# Altium schematic sheet SPDT_FET_SW_driver.SchDoc: AEGIS
size 420 x 297 mm; Author: G.Kasprowicz; CompanyName: WUT ISE; DrawnBy: G.Kasprowicz; Organization: WUT ISE; Address1: PW ISE; Address2: Nowowiejska 15/19 00-665 Warsaw; Address3: gkasprow@gmail.com; Revision: 2; SheetNumber: -; SheetTotal: -; ModifiedBy: -; CheckedDate: -; Title2: Switch driver; DivGrp: WUT ISE; Designer: G.Kasprowicz; ModifiedDate: -; ProjectName: Sensor Box
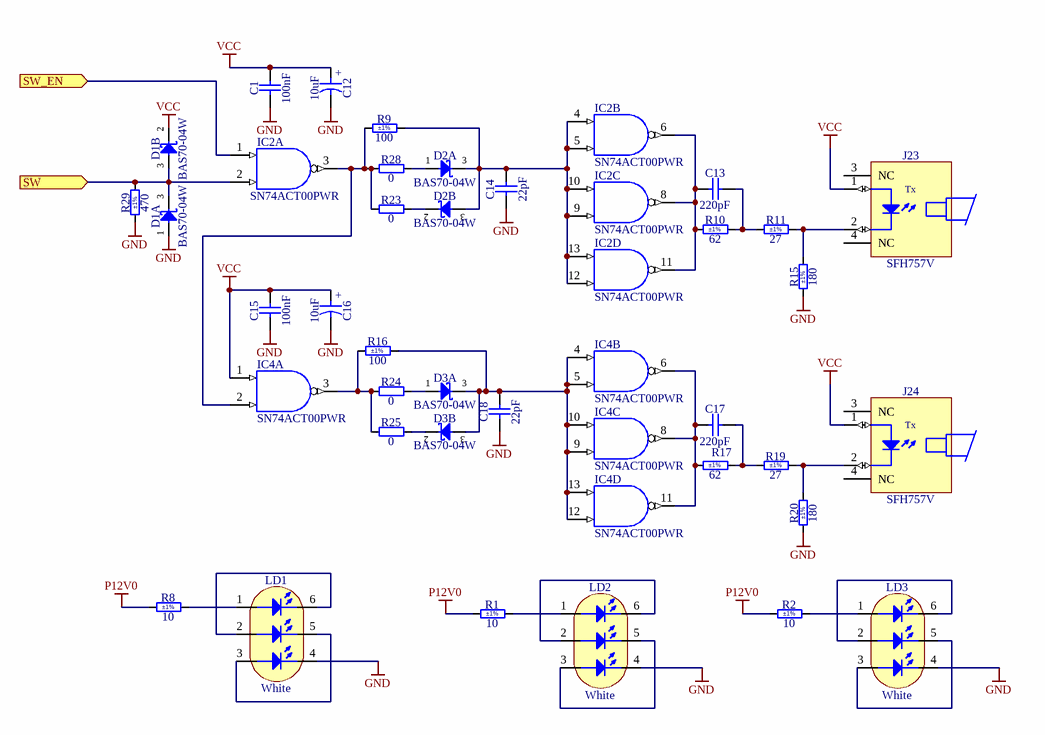
[diagram p0: SPDT_FET_SW_driver.SchDoc]

## Parts
C1  100nF  [CAPC1005X55N]
C12  10uF  [CAPMP3216X180N]
C13  220pF  [CAPC1608X87N]
C14  22pF  [CAPC1608X87N]
C15  100nF  [CAPC1005X55N]
C16  10uF  [CAPMP3216X180N]
C17  220pF  [CAPC1608X87N]
C18  22pF  [CAPC1608X87N]
D1  BAS70-04W  [SOT65P210X110-3N]  (parts A,B of 2)
D2  BAS70-04W  [SOT65P210X110-3N]  (parts A,B of 2)
D3  BAS70-04W  [SOT65P210X110-3N]  (parts A,B of 2)
IC2  SN74ACT00PWR  [SOP65P640X120-14N]  (parts A,B,C,D of 4)
IC4  SN74ACT00PWR  [SOP65P640X120-14N]  (parts A,B,C,D of 4)
J23  SFH757V  [SFH756V]
J24  SFH757V  [SFH756V]
LD1  White  [LED_CREE_CLP6B-WKW]
LD2  White  [LED_CREE_CLP6B-WKW]
LD3  White  [LED_CREE_CLP6B-WKW]
R1  10  Tolerance: ±1%  [RESC3216X65N]
R2  10  Tolerance: ±1%  [RESC3216X65N]
R8  10  Tolerance: ±1%  [RESC3216X65N]
R9  100  Tolerance: ±1%  [RESC1608X55N]
R10  62  Tolerance: ±1%  [RESC2012X60N]
R11  27  Tolerance: ±1%  [RESC2012X60N]
R15  180  Tolerance: ±1%  [RESC3216X65N]
R16  100  Tolerance: ±1%  [RESC1608X55N]
R17  62  Tolerance: ±1%  [RESC2012X60N]
R19  27  Tolerance: ±1%  [RESC2012X60N]
R20  180  Tolerance: ±1%  [RESC3216X65N]
R23  0  [RESC1608X55N]
R24  0  [RESC1608X55N]
R25  0  [RESC1608X55N]
R28  0  [RESC1608X55N]
R29  470  Tolerance: ±1%  [RESC1608X55N]

## Ports
SW (in), SW_EN (in)

## Nets
GND: C1.1 C12.2 C14.1 C15.1 C16.2 C18.1 D1.1(A) IC2.7(GND) IC4.7(GND) LD1.4(C3) LD2.4(C3) LD3.4(C3) R15.1 R20.1 R29.1
P12V0: R1.1 R2.1 R8.1
VCC: C1.2 C12.1 C15.2 C16.1 D1.2(C) IC2.14(VCC) IC4.1(A) IC4.14(VCC) J23.1(A) J24.1(A)
SW: D1.3(COMAC) IC2.2(B) R29.2 ; port SW
SW_EN: IC2.1(A) ; port SW_EN
NetC13_1: C13.1 IC2.6(~{O}) IC2.8(~{O}) IC2.11(~{O}) R10.1
NetC13_2: C13.2 R10.2 R11.1
NetC14_2: C14.2 D2.3(COMAC) IC2.4(A) IC2.5(B) IC2.9(B) IC2.10(A) IC2.12(B) IC2.13(A) R9.2
NetC17_1: C17.1 IC4.6(~{O}) IC4.8(~{O}) IC4.11(~{O}) R17.1
NetC17_2: C17.2 R17.2 R19.1
NetC18_2: C18.2 D3.3(COMAC) IC4.4(A) IC4.5(B) IC4.9(B) IC4.10(A) IC4.12(B) IC4.13(A) R16.2
NetD2_1: D2.1(A) R28.2
NetD2_2: D2.2(C) R23.2
NetD3_1: D3.1(A) R24.2
NetD3_2: D3.2(C) R25.2
NetIC2_3: IC2.3(~{O}) IC4.2(B) R9.1 R23.1 R28.1
NetIC4_3: IC4.3(~{O}) R16.1 R24.1 R25.1
NetJ23_2: J23.2(C) R11.2 R15.2
NetJ24_2: J24.2(C) R19.2 R20.2
NetLD1_1: LD1.1(A1) R8.2
NetLD1_2: LD1.2(A2) LD1.6(C1)
NetLD1_3: LD1.3(A3) LD1.5(C2)
NetLD2_1: LD2.1(A1) R1.2
NetLD2_2: LD2.2(A2) LD2.6(C1)
NetLD2_3: LD2.3(A3) LD2.5(C2)
NetLD3_1: LD3.1(A1) R2.2
NetLD3_2: LD3.2(A2) LD3.6(C1)
NetLD3_3: LD3.3(A3) LD3.5(C2)

Not connected (* = marked no-connect by the designer): J23 3(NC) 4(NC); J24 3(NC) 4(NC)

## Notes on the sheet
- Project/Equipment
- Document
- Designer
- Drawn by
- Check.by
- Copyright WUT ISE 2020.
  This documentation describes Open Hardware and is licensed under the CERN OHL v.1.2. You may redistribute and modify this documentation under the terms of the CERN OHL v.1.2. (http://ohwr.org/CERNOHL). This documentation is distributed WITHOUT ANY EXPRESS OR IMPLIED WARRANTY, INCLUDING OF MERCHANTABILITY, SATISFACTORY QUALITY AND FITNESS FOR A PARTICULAR PURPOSE. Please see the CERN OHL v.1.2 for applicable conditions.
- Contact
- File
- Last Mod.
- Print Date
- Sheet
- Size
- A3
- of
- Rev
- (in symbol CTE3216-18_10UF_16V_20%_AVX_TCJ) +
- (in symbol SFH756V) Tx

## Library data of the parts
C1 C15 = CC0402_100NF_16V_10%_X7R: Non-polarised capacitor; Part Description: SMD Multilayer Chip Ceramic Capacitor; Manufacturer: GENERIC; Manufacturer1 Part Number: GRM155R71C104KA88D; Voltage: 16V; TC: X7R; Tolerance: ±10%; Part Number: CC0402_100NF_16V_10%_X7R; Component Kind: Standard; Component Type: Standard; Pin Count: 2; Value: 100nF; Status: Not Recommended; Manufacturer Part Number: CC0402_100NF_16V_10%_X7R; Case: 0402; Mounted: Yes; Socket: No; SMD: Yes; Sense: No; Manufacturer1 Example: MURATA; Manufacturer1 ComponentHeight: 0.55mm; HelpURL: \\cern.ch\dfs\Applications\Altium\Datasheets\CC0402_X7R_MURATA_GRM.pdf; Author: CERN DEM JLC; CreateDate: 05.12.2013; LatestRevisionDate: 03.12.2007
C12 C16 = CTE3216-18_10UF_16V_20%_AVX_TCJ: Polarised capacitor; Part Description: ESR 0R200 Tantalum Solid Electrolytic Chip Capacitor with Conductive Polymer Electrode; Manufacturer: AVX; Manufacturer Part Number: TCJA106M016R0200; Voltage: 16V; Tolerance: ±20%; Part Number: CTE3216-18_10UF_16V_20%_AVX_TCJ; Component Kind: Standard; Component Type: Standard; Pin Count: 2; Value: 10uF; Status: Preferred; Case: A; Mounted: Yes; Socket: No; SMD: Yes; Sense: No; ComponentHeight: 1.8mm; HelpURL: \\cern.ch\dfs\Applications\Altium\Datasheets\CTE_AVX_TCJ.pdf; Author: CERN DEM JLC; CreateDate: 29.03.2012; LatestRevisionDate: 29.03.2012
C13 C17 = CC0603_220PF_50V_5%_NP0: Non-polarised capacitor; Part Description: SMD Multilayer Chip Ceramic Capacitor; Manufacturer: GENERIC; Manufacturer1 Part Number: 223886715221; Voltage: 50V; TC: C0G/NP0; Tolerance: ±5%; Part Number: CC0603_220PF_50V_5%_NP0; Component Kind: Standard; Component Type: Standard; Pin Count: 2; Value: 220pF; Status: Preferred; Manufacturer Part Number: CC0603_220PF_50V_5%_NP0; Case: 0603; Mounted: Yes; Socket: No; SMD: Yes; Sense: No; Manufacturer1 Example: PHYCOMP; Manufacturer1 ComponentHeight: 0.87mm; HelpURL: \\cern.ch\dfs\Applications\Altium\Datasheets\CC0603_NP0_PHYCOMP.pdf; Author: CERN DEM JLC; CreateDate: 03.12.2007; LatestRevisionDate: 03.12.2007
C14 C18 = CC0603_22PF_50V_5%_NP0: Non-polarised capacitor; Part Description: SMD Multilayer Chip Ceramic Capacitor; Manufacturer: GENERIC; Manufacturer1 Part Number: 223886715229; Voltage: 50V; TC: C0G/NP0; Tolerance: ±5%; Part Number: CC0603_22PF_50V_5%_NP0; Component Kind: Standard; Component Type: Standard; Pin Count: 2; Value: 22pF; Status: Preferred; Manufacturer Part Number: CC0603_22PF_50V_5%_NP0; Case: 0603; Mounted: Yes; Socket: No; SMD: Yes; Sense: No; Manufacturer1 Example: PHYCOMP; Manufacturer1 ComponentHeight: 0.87mm; HelpURL: \\cern.ch\dfs\Applications\Altium\Datasheets\CC0603_NP0_PHYCOMP.pdf; Author: CERN DEM JLC; CreateDate: 03.12.2007; LatestRevisionDate: 03.12.2007
D1-D3 = BAS70-04W: Serial Schottky Diode; Part Description: Dual Series General-Purpose Schottky Diodes; Manufacturer: NXP SEMICONDUCTORS; Voltage: 70V; Power: 70mA; PressFit: No; Bonding: No; Part Number: BAS70-04W; Component Kind: Standard; Component Type: Standard; Device: BAS70-04W; PackageDescription: SOT323, 0.65mm Pitch; 3 Pin, 1.25mm W X 2.00mm L X 1.10mm H body, IPC Medium Density; Manufacturer Part Number: BAS70-04W; Pin Count: 3; Case: SOT323; Mounted: Yes; Socket: No; SMD: Yes; Sense: No; ComponentHeight: 1.10mm; HelpURL: \\cern.ch\dfs\Applications\Altium\Datasheets\BAS70-04W.pdf; Author: CERN DEM JLC; CreateDate: 05.12.2013; LatestRevisionDate: 05.12.2013
IC2 IC4 = SN74ACT00PWR: Quad 2-Input NAND Gate; Part Description: Quadruple 2-Input Positive-NAND Gate; Manufacturer: TEXAS INSTRUMENTS; PressFit: No; Bonding: No; Part Number: SN74ACT00PWR; Component Kind: Standard; Component Type: Standard; Device: SN74ACT00PWR; PackageDescription: SOP, 0.65mm Pitch; 14 Pin, 4.40mm W X 5.00mm L X 1.20mm H body, IPC Medium Density; Manufacturer Part Number: SN74ACT00PWR; Pin Count: 14; Case: TSSOP14; Mounted: Yes; Socket: No; SMD: Yes; Sense: No; ComponentHeight: 1.2mm; Author: CERN DEM JLC; HelpURL: \\cern.ch\dfs\Applications\Altium\Datasheets\SN74ACT00PWR.pdf; CreateDate: 17.03.2014; LatestRevisionDate: 17.03.2014
J23 J24 = SFH756V: Plastic Connector Housing For Plastic Fiber Optic Photodiode Detector; Part Description: 100MBd Transmitter with Direct Fiber Connector; Manufacturer: AVAGO TECHNOLOGIES; Manufacturer Part Number: SFH756V or SP000063814; PressFit: No; Part Number: SFH757V; Component Kind: Standard; Component Type: Standard; Device: SFH757V; Footprint: SFH757V; Pin Count: 4; Family: SFH757V; Mounted: Yes; Socket: No; SMD: No; Sense: No; Status: None; ComponentHeight: 9mm; HelpURL: \\cern.ch\dfs\Applications\Altium\Datasheets\SFH756V.pdf; Author: CERN DEM JLC; CreateDate: 11.11.2009; LatestRevisionDate: 21.08.2014
LD1-LD3 = LED_CREE_CLP6B-WKW-CD0E0233: PLCC6 3 in 1 Surface Mount, Cool White LED; Manufacturer: CREE; PressFit: No; Bonding: No; Part Number: LED_CREE_CLP6B-WKW-CD0E0233; Component Kind: Standard; Component Type: Standard; Color: White; PackageDescription: PLCC6 3 in 1 Surface Mount White LED, Body 6.0mm X 5.0mm; Part Description: PLCC6 3 in 1 Surface Mount, Cool White LED; Manufacturer Part Number: CLP6B-WKW-CD0E0233; Pin Count: 6; Mounted: Yes; Socket: No; SMD: Yes; Sense: No; ComponentHeight: 2.6mm; HelpURL: \\cern.ch\dfs\Applications\Altium\Datasheets\LED_CREE_CLP6B-WKW-CD0E0233.pdf; Author: CERN DEM JMW; CreateDate: 04.02.2020; LatestRevisionDate: 04.02.2020
R1 R2 R8 = R1206_10R_1%_0.25W_100PPM: Resistor - 1%; Part Description: General Purpose Thick Film Chip Resistor; Manufacturer: GENERIC; Manufacturer1 Part Number: NRC12F10R0TRF; Power: 0.25W; TC: ±100ppm/°C; PressFit: No; Part Number: R1206_10R_1%_0.25W_100PPM; Component Kind: Standard; Component Type: Standard; Pin Count: 2; Value: 10; Status: Preferred; Manufacturer Part Number: R1206_10R_1%_0.25W_100PPM; Case: 1206; Mounted: Yes; Sense: No; Socket: No; SMD: Yes; Manufacturer1 Example: NIC COMPONENT; Manufacturer1 ComponentHeight: 0.65mm; HelpURL: \\cern.ch\dfs\Applications\Altium\Datasheets\R1206_NIC_NRC.pdf; Author: CERN DEM BC; CreateDate: 14.12.2020; LatestRevisionDate: 14.12.2020
R9 R16 = R0603_100R_1%_0.1W_100PPM: Resistor - 1%; Part Description: General Purpose Thick Film Chip Resistor; Manufacturer: GENERIC; Manufacturer1 Part Number: NRC06F4700TRF; Power: 0.1W; TC: ±100ppm/°C; PressFit: No; Part Number: R0603_100R_1%_0.1W_100PPM; Component Kind: Standard; Component Type: Standard; Pin Count: 2; Value: 100; Status: Preferred; Manufacturer Part Number: R0603_100R_1%_0.1W_100PPM; Case: 0603; Mounted: Yes; Sense: No; Socket: No; SMD: Yes; Manufacturer1 Example: NIC COMPONENT; Manufacturer1 ComponentHeight: 0.55mm; HelpURL: \\cern.ch\dfs\Applications\Altium\Datasheets\R0603_NIC_NRC.pdf; Author: CERN DEM JLC; CreateDate: 03.12.2007; LatestRevisionDate: 13.03.2008
R10 R17 = R0805_62R_1%_0.125W_100PPM: Resistor - 1%; Part Description: General Purpose Thick Film Chip Resistor; Manufacturer: GENERIC; Manufacturer1 Part Number: NRC10F62R0TRF; Power: 0.125W; TC: ±100ppm/°C; PressFit: No; Part Number: R0805_62R_1%_0.125W_100PPM; Component Kind: Standard; Component Type: Standard; Pin Count: 2; Value: 62; Status: Preferred; Manufacturer Part Number: R0805_62R_1%_0.125W_100PPM; Case: 0805; Mounted: Yes; Sense: No; Socket: No; SMD: Yes; Manufacturer1 Example: NIC COMPONENT; Manufacturer1 ComponentHeight: 0.6mm; HelpURL: \\cern.ch\dfs\Applications\Altium\Datasheets\R0805_NIC_NRC.pdf; Author: CERN DEM JLC; CreateDate: 03.12.2007; LatestRevisionDate: 13.03.2008
R11 R19 = R0805_27R_1%_0.125W_100PPM: Resistor - 1%; Part Description: General Purpose Thick Film Chip Resistor; Manufacturer: GENERIC; Manufacturer1 Part Number: NRC10F27R0TRF; Power: 0.125W; TC: ±100ppm/°C; PressFit: No; Part Number: R0805_27R_1%_0.125W_100PPM; Component Kind: Standard; Component Type: Standard; Pin Count: 2; Value: 27; Status: Preferred; Manufacturer Part Number: R0805_27R_1%_0.125W_100PPM; Case: 0805; Mounted: Yes; Sense: No; Socket: No; SMD: Yes; Manufacturer1 Example: NIC COMPONENT; Manufacturer1 ComponentHeight: 0.6mm; HelpURL: \\cern.ch\dfs\Applications\Altium\Datasheets\R0805_NIC_NRC.pdf; Author: CERN DEM JLC; CreateDate: 03.12.2007; LatestRevisionDate: 13.03.2008
R15 R20 = R1206_180R_1%_0.25W_100PPM: Resistor - 1%; Part Description: General Purpose Thick Film Chip Resistor; Manufacturer: GENERIC; Manufacturer1 Part Number: NRC12F1800TRF; Power: 0.25W; TC: ±100ppm/°C; PressFit: No; Part Number: R1206_180R_1%_0.25W_100PPM; Component Kind: Standard; Component Type: Standard; Pin Count: 2; Value: 180; Status: Preferred; Manufacturer Part Number: R1206_180R_1%_0.25W_100PPM; Case: 1206; Mounted: Yes; Sense: No; Socket: No; SMD: Yes; Manufacturer1 Example: NIC COMPONENT; Manufacturer1 ComponentHeight: 0.65mm; HelpURL: \\cern.ch\dfs\Applications\Altium\Datasheets\R1206_NIC_NRC.pdf; Author: CERN DEM JLC; CreateDate: 03.12.2007; LatestRevisionDate: 13.03.2008
R23-R25 R28 = R0603_0R_JUMPER: Resistor; Part Description: 1A (0.05R Max DC Resistance) Zero Ohm Jumper; Manufacturer: GENERIC; Manufacturer1 Part Number: NRC06Z0; PressFit: No; Part Number: R0603_0R_JUMPER; Component Kind: Standard; Component Type: Standard; Pin Count: 2; Value: 0; Status: Preferred; Manufacturer Part Number: R0603_0R_JUMPER; Case: 0603; Mounted: Yes; Sense: No; Socket: No; SMD: Yes; Manufacturer1 Example: NIC COMPONENT; Manufacturer1 ComponentHeight: 0.55mm; HelpURL: \\cern.ch\dfs\Applications\Altium\Datasheets\R0603_NIC_NRC.pdf; Author: CERN DEM JLC; CreateDate: 03.12.2007; LatestRevisionDate: 13.03.2008
R29 = R0603_470R_1%_0.1W_100PPM: Resistor - 1%; Part Description: General Purpose Thick Film Chip Resistor; Manufacturer: GENERIC; Manufacturer1 Part Number: NRC06F4700TRF; Power: 0.1W; TC: ±100ppm/°C; PressFit: No; Part Number: R0603_470R_1%_0.1W_100PPM; Component Kind: Standard; Component Type: Standard; Pin Count: 2; Value: 470; Status: Preferred; Manufacturer Part Number: R0603_470R_1%_0.1W_100PPM; Case: 0603; Mounted: Yes; Sense: No; Socket: No; SMD: Yes; Manufacturer1 Example: NIC COMPONENT; Manufacturer1 ComponentHeight: 0.55mm; HelpURL: \\cern.ch\dfs\Applications\Altium\Datasheets\R0603_NIC_NRC.pdf; Author: CERN DEM JLC; CreateDate: 03.12.2007; LatestRevisionDate: 13.03.2008